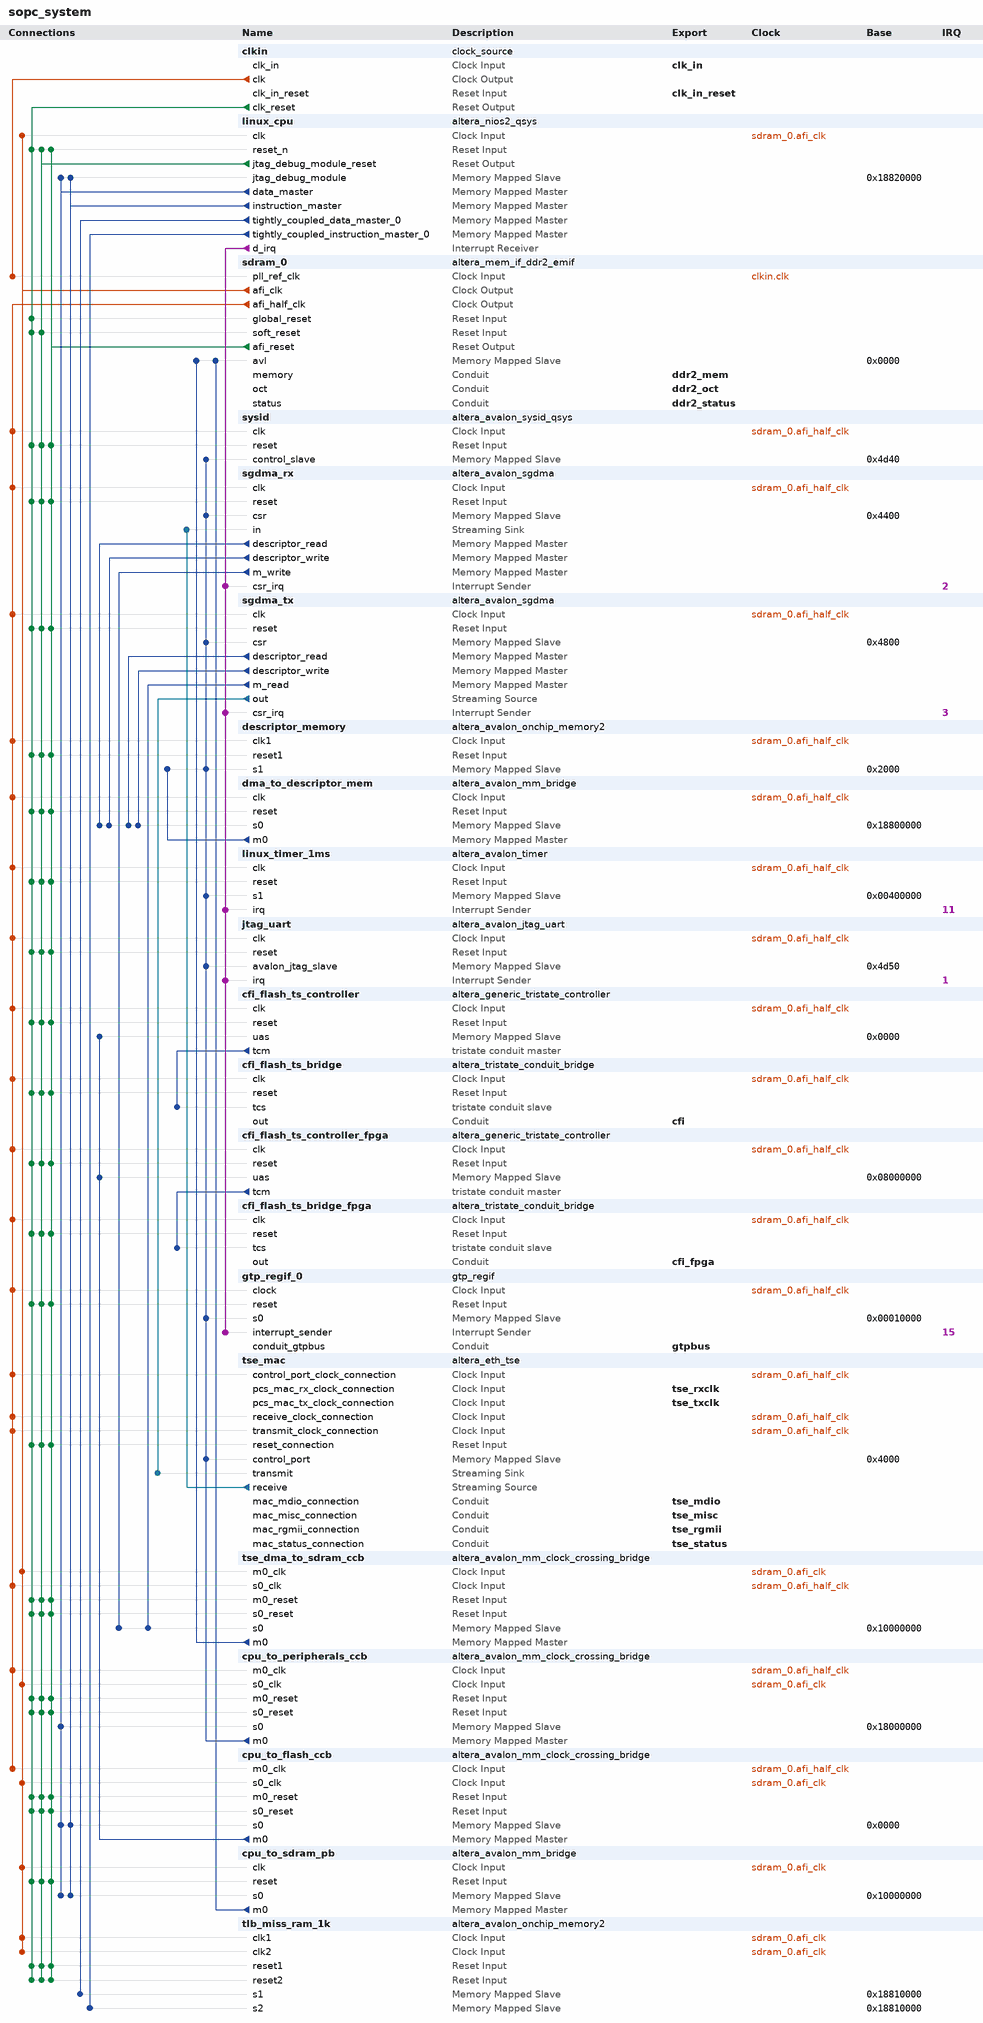
[diagram p0: system contents]
# Platform Designer (Qsys) system sopc_system, Stratix IV EP4SGX180KF40C3
# Parameters at their usual value, and those the tool derives, are not listed.
package require -exact qsys 13.0
create_system sopc_system
set_project_property DEVICE_FAMILY {Stratix IV}
set_project_property DEVICE EP4SGX180KF40C3

add_instance clkin clock_source 13.0
set_instance_parameter_value clkin clockFrequency 250000000
set_instance_parameter_value clkin resetSynchronousEdges BOTH

add_instance linux_cpu altera_nios2_qsys 13.0
set_instance_parameter_value linux_cpu muldiv_divider true
set_instance_parameter_value linux_cpu mmu_enabled true
set_instance_parameter_value linux_cpu cpuID 4674640
set_instance_parameter_value linux_cpu resetSlave cfi_flash_ts_controller.uas
set_instance_parameter_value linux_cpu mmu_TLBMissExcSlave tlb_miss_ram_1k.s2
set_instance_parameter_value linux_cpu exceptionSlave sdram_0.avl
set_instance_parameter_value linux_cpu breakSlave linux_cpu.jtag_debug_module
set_instance_parameter_value linux_cpu muldiv_multiplierType DSPBlock
set_instance_parameter_value linux_cpu impl Fast
set_instance_parameter_value linux_cpu icache_size 32768
set_instance_parameter_value linux_cpu icache_numTCIM 1
set_instance_parameter_value linux_cpu dcache_size 32768
set_instance_parameter_value linux_cpu dcache_numTCDM 1

add_instance sdram_0 altera_mem_if_ddr2_emif 13.0
set_instance_parameter_value sdram_0 MEM_CLK_FREQ 375.0
set_instance_parameter_value sdram_0 MEM_FORMAT DISCRETE
set_instance_parameter_value sdram_0 MEM_ROW_ADDR_WIDTH 13
set_instance_parameter_value sdram_0 MEM_COL_ADDR_WIDTH 10
set_instance_parameter_value sdram_0 MEM_DQ_WIDTH 16
set_instance_parameter_value sdram_0 MEM_BANKADDR_WIDTH 3
set_instance_parameter_value sdram_0 MEM_NUMBER_OF_RANKS_PER_DIMM 1
set_instance_parameter_value sdram_0 MEM_CK_WIDTH 1
set_instance_parameter_value sdram_0 MEM_BL 4
set_instance_parameter_value sdram_0 MEM_SRT {1x refresh rate}
set_instance_parameter_value sdram_0 MEM_TCL 5
set_instance_parameter_value sdram_0 TIMING_TIS 175
set_instance_parameter_value sdram_0 TIMING_TIH 250
set_instance_parameter_value sdram_0 TIMING_TDS 50
set_instance_parameter_value sdram_0 TIMING_TDH 125
set_instance_parameter_value sdram_0 TIMING_TDQSQ 200
set_instance_parameter_value sdram_0 TIMING_TQHS 300
set_instance_parameter_value sdram_0 MEM_TMRD_CK 2
set_instance_parameter_value sdram_0 MEM_TRAS_NS 40.0
set_instance_parameter_value sdram_0 MEM_TRCD_NS 12.5
set_instance_parameter_value sdram_0 MEM_TRP_NS 12.5
set_instance_parameter_value sdram_0 MEM_TRFC_NS 195.0
set_instance_parameter_value sdram_0 MEM_TFAW_NS 45.0
set_instance_parameter_value sdram_0 MEM_TRRD_NS 10.0
set_instance_parameter_value sdram_0 SPEED_GRADE 3
set_instance_parameter_value sdram_0 POWER_OF_TWO_BUS false
set_instance_parameter_value sdram_0 AVL_MAX_SIZE 4
set_instance_parameter_value sdram_0 REF_CLK_FREQ 250.0
set_instance_parameter_value sdram_0 DEFAULT_FAST_SIM_MODEL true
set_instance_parameter_value sdram_0 PLL_SHARING_MODE None
set_instance_parameter_value sdram_0 EXPORT_AFI_HALF_CLK true
set_instance_parameter_value sdram_0 SKIP_MEM_INIT false
set_instance_parameter_value sdram_0 CALIBRATION_MODE Full
set_instance_parameter_value sdram_0 USER_DEBUG_LEVEL 0
set_instance_parameter_value sdram_0 TIMING_BOARD_AC_TO_CK_SKEW 0.0
set_instance_parameter_value sdram_0 CORE_DEBUG_CONNECTION INTERNAL_JTAG
set_instance_parameter_value sdram_0 DLL_SHARING_MODE None

add_instance sysid altera_avalon_sysid_qsys 13.0
set_instance_parameter_value sysid id 4674640

add_instance sgdma_rx altera_avalon_sgdma 13.0.1.99.2
set_instance_parameter_value sgdma_rx enableBurstTransfers false
set_instance_parameter_value sgdma_rx enableUnalignedTransfers false
set_instance_parameter_value sgdma_rx readBlockDataWidth 32
set_instance_parameter_value sgdma_rx sinkErrorWidth 6
set_instance_parameter_value sgdma_rx sourceErrorWidth 0
set_instance_parameter_value sgdma_rx transferMode STREAM_TO_MEMORY
set_instance_parameter_value sgdma_rx writeBurstcountWidth 4

add_instance sgdma_tx altera_avalon_sgdma 13.0.1.99.2
set_instance_parameter_value sgdma_tx enableBurstTransfers false
set_instance_parameter_value sgdma_tx enableUnalignedTransfers false
set_instance_parameter_value sgdma_tx readBlockDataWidth 32
set_instance_parameter_value sgdma_tx sinkErrorWidth 0
set_instance_parameter_value sgdma_tx sourceErrorWidth 1
set_instance_parameter_value sgdma_tx transferMode MEMORY_TO_STREAM
set_instance_parameter_value sgdma_tx writeBurstcountWidth 4

add_instance descriptor_memory altera_avalon_onchip_memory2 13.0.1.99.2
set_instance_parameter_value descriptor_memory dataWidth 32
set_instance_parameter_value descriptor_memory dualPort false
set_instance_parameter_value descriptor_memory initMemContent true
set_instance_parameter_value descriptor_memory initializationFileName descriptor_memory
set_instance_parameter_value descriptor_memory memorySize 8192

add_instance dma_to_descriptor_mem altera_avalon_mm_bridge 13.0
set_instance_parameter_value dma_to_descriptor_mem DATA_WIDTH 32
set_instance_parameter_value dma_to_descriptor_mem ADDRESS_WIDTH 14
set_instance_parameter_value dma_to_descriptor_mem ADDRESS_UNITS SYMBOLS
set_instance_parameter_value dma_to_descriptor_mem MAX_PENDING_RESPONSES 4

add_instance linux_timer_1ms altera_avalon_timer 13.0.1.99.2
set_instance_parameter_value linux_timer_1ms period 1
set_instance_parameter_value linux_timer_1ms periodUnits MSEC

add_instance jtag_uart altera_avalon_jtag_uart 13.0.1.99.2
set_instance_parameter_value jtag_uart simInteractiveOptions INTERACTIVE_ASCII_OUTPUT

add_instance cfi_flash_ts_controller altera_generic_tristate_controller 13.0
set_instance_parameter_value cfi_flash_ts_controller TCM_ADDRESS_W 27
set_instance_parameter_value cfi_flash_ts_controller TCM_DATA_W 16
set_instance_parameter_value cfi_flash_ts_controller TCM_BYTEENABLE_W 2
set_instance_parameter_value cfi_flash_ts_controller TCM_READ_WAIT 230
set_instance_parameter_value cfi_flash_ts_controller TCM_WRITE_WAIT 230
set_instance_parameter_value cfi_flash_ts_controller TCM_SETUP_WAIT 65
set_instance_parameter_value cfi_flash_ts_controller TCM_DATA_HOLD 35
set_instance_parameter_value cfi_flash_ts_controller TCM_MAX_PENDING_READ_TRANSACTIONS 3
set_instance_parameter_value cfi_flash_ts_controller TCM_TURNAROUND_TIME 2
set_instance_parameter_value cfi_flash_ts_controller TCM_TIMING_UNITS 0
set_instance_parameter_value cfi_flash_ts_controller TCM_READLATENCY 2
set_instance_parameter_value cfi_flash_ts_controller TCM_SYMBOLS_PER_WORD 2
set_instance_parameter_value cfi_flash_ts_controller USE_READ 0
set_instance_parameter_value cfi_flash_ts_controller USE_BEGINTRANSFER 0
set_instance_parameter_value cfi_flash_ts_controller USE_BYTEENABLE 0
set_instance_parameter_value cfi_flash_ts_controller USE_OUTPUTENABLE 1
set_instance_parameter_value cfi_flash_ts_controller USE_RESET_OUTPUT 1
set_instance_parameter_value cfi_flash_ts_controller ACTIVE_LOW_READ 1
set_instance_parameter_value cfi_flash_ts_controller ACTIVE_LOW_BYTEENABLE 0
set_instance_parameter_value cfi_flash_ts_controller ACTIVE_LOW_OUTPUTENABLE 1
set_instance_parameter_value cfi_flash_ts_controller ACTIVE_LOW_BEGINTRANSFER 0
set_instance_parameter_value cfi_flash_ts_controller ACTIVE_LOW_RESET_OUTPUT 1
set_instance_parameter_value cfi_flash_ts_controller CHIPSELECT_THROUGH_READLATENCY 0
set_instance_parameter_value cfi_flash_ts_controller MODULE_ASSIGNMENT_KEYS embeddedsw.configuration.hwClassnameDriverSupportList,embeddedsw.configuration.hwClassnameDriverSupportDefault,embeddedsw.CMacro.SETUP_VALUE,embeddedsw.CMacro.WAIT_VALUE,embeddedsw.CMacro.HOLD_VALUE,embeddedsw.CMacro.TIMING_UNITS,embeddedsw.CMacro.SIZE,embeddedsw.memoryInfo.MEM_INIT_DATA_WIDTH,embeddedsw.memoryInfo.HAS_BYTE_LANE,embeddedsw.memoryInfo.IS_FLASH,embeddedsw.memoryInfo.GENERATE_DAT_SYM,embeddedsw.memoryInfo.GENERATE_FLASH,embeddedsw.memoryInfo.DAT_SYM_INSTALL_DIR,embeddedsw.memoryInfo.FLASH_INSTALL_DIR
set_instance_parameter_value cfi_flash_ts_controller MODULE_ASSIGNMENT_VALUES altera_avalon_lan91c111:altera_avalon_cfi_flash,altera_avalon_cfi_flash,50,200,10,ns,134217728u,16,0,1,1,1,SIM_DIR,APP_DIR

add_instance cfi_flash_ts_bridge altera_tristate_conduit_bridge 13.0

add_instance cfi_flash_ts_controller_fpga altera_generic_tristate_controller 13.0
set_instance_parameter_value cfi_flash_ts_controller_fpga TCM_ADDRESS_W 27
set_instance_parameter_value cfi_flash_ts_controller_fpga TCM_DATA_W 16
set_instance_parameter_value cfi_flash_ts_controller_fpga TCM_BYTEENABLE_W 2
set_instance_parameter_value cfi_flash_ts_controller_fpga TCM_READ_WAIT 230
set_instance_parameter_value cfi_flash_ts_controller_fpga TCM_WRITE_WAIT 230
set_instance_parameter_value cfi_flash_ts_controller_fpga TCM_SETUP_WAIT 65
set_instance_parameter_value cfi_flash_ts_controller_fpga TCM_DATA_HOLD 35
set_instance_parameter_value cfi_flash_ts_controller_fpga TCM_MAX_PENDING_READ_TRANSACTIONS 3
set_instance_parameter_value cfi_flash_ts_controller_fpga TCM_TURNAROUND_TIME 2
set_instance_parameter_value cfi_flash_ts_controller_fpga TCM_TIMING_UNITS 0
set_instance_parameter_value cfi_flash_ts_controller_fpga TCM_READLATENCY 2
set_instance_parameter_value cfi_flash_ts_controller_fpga TCM_SYMBOLS_PER_WORD 2
set_instance_parameter_value cfi_flash_ts_controller_fpga USE_READ 0
set_instance_parameter_value cfi_flash_ts_controller_fpga USE_BEGINTRANSFER 0
set_instance_parameter_value cfi_flash_ts_controller_fpga USE_BYTEENABLE 0
set_instance_parameter_value cfi_flash_ts_controller_fpga USE_OUTPUTENABLE 1
set_instance_parameter_value cfi_flash_ts_controller_fpga USE_RESET_OUTPUT 1
set_instance_parameter_value cfi_flash_ts_controller_fpga ACTIVE_LOW_READ 1
set_instance_parameter_value cfi_flash_ts_controller_fpga ACTIVE_LOW_BYTEENABLE 0
set_instance_parameter_value cfi_flash_ts_controller_fpga ACTIVE_LOW_OUTPUTENABLE 1
set_instance_parameter_value cfi_flash_ts_controller_fpga ACTIVE_LOW_BEGINTRANSFER 0
set_instance_parameter_value cfi_flash_ts_controller_fpga ACTIVE_LOW_RESET_OUTPUT 1
set_instance_parameter_value cfi_flash_ts_controller_fpga CHIPSELECT_THROUGH_READLATENCY 0
set_instance_parameter_value cfi_flash_ts_controller_fpga MODULE_ASSIGNMENT_KEYS embeddedsw.configuration.hwClassnameDriverSupportList,embeddedsw.configuration.hwClassnameDriverSupportDefault,embeddedsw.CMacro.SETUP_VALUE,embeddedsw.CMacro.WAIT_VALUE,embeddedsw.CMacro.HOLD_VALUE,embeddedsw.CMacro.TIMING_UNITS,embeddedsw.CMacro.SIZE,embeddedsw.memoryInfo.MEM_INIT_DATA_WIDTH,embeddedsw.memoryInfo.HAS_BYTE_LANE,embeddedsw.memoryInfo.IS_FLASH,embeddedsw.memoryInfo.GENERATE_DAT_SYM,embeddedsw.memoryInfo.GENERATE_FLASH,embeddedsw.memoryInfo.DAT_SYM_INSTALL_DIR,embeddedsw.memoryInfo.FLASH_INSTALL_DIR
set_instance_parameter_value cfi_flash_ts_controller_fpga MODULE_ASSIGNMENT_VALUES altera_avalon_lan91c111:altera_avalon_cfi_flash,altera_avalon_cfi_flash,50,200,10,ns,134217728u,16,0,1,1,1,SIM_DIR,APP_DIR

add_instance cfi_flash_ts_bridge_fpga altera_tristate_conduit_bridge 13.0

add_instance gtp_regif_0 gtp_regif 1.0

add_instance tse_mac altera_eth_tse 13.0
set_instance_parameter_value tse_mac core_variation MAC_ONLY
set_instance_parameter_value tse_mac ifGMII RGMII
set_instance_parameter_value tse_mac transceiver_type NONE
set_instance_parameter_value tse_mac enable_hd_logic true
set_instance_parameter_value tse_mac stat_cnt_ena true
set_instance_parameter_value tse_mac enable_shift16 true
set_instance_parameter_value tse_mac enable_mac_flow_ctrl true
set_instance_parameter_value tse_mac enable_magic_detect false
set_instance_parameter_value tse_mac mdio_clk_div 80
set_instance_parameter_value tse_mac ing_addr 11

add_instance tse_dma_to_sdram_ccb altera_avalon_mm_clock_crossing_bridge 13.0
set_instance_parameter_value tse_dma_to_sdram_ccb DATA_WIDTH 32
set_instance_parameter_value tse_dma_to_sdram_ccb ADDRESS_WIDTH 27
set_instance_parameter_value tse_dma_to_sdram_ccb MAX_BURST_SIZE 1
set_instance_parameter_value tse_dma_to_sdram_ccb COMMAND_FIFO_DEPTH 4
set_instance_parameter_value tse_dma_to_sdram_ccb RESPONSE_FIFO_DEPTH 4
set_instance_parameter_value tse_dma_to_sdram_ccb MASTER_SYNC_DEPTH 2
set_instance_parameter_value tse_dma_to_sdram_ccb SLAVE_SYNC_DEPTH 2

add_instance cpu_to_peripherals_ccb altera_avalon_mm_clock_crossing_bridge 13.0
set_instance_parameter_value cpu_to_peripherals_ccb DATA_WIDTH 32
set_instance_parameter_value cpu_to_peripherals_ccb ADDRESS_WIDTH 23
set_instance_parameter_value cpu_to_peripherals_ccb MAX_BURST_SIZE 1
set_instance_parameter_value cpu_to_peripherals_ccb COMMAND_FIFO_DEPTH 4
set_instance_parameter_value cpu_to_peripherals_ccb RESPONSE_FIFO_DEPTH 4
set_instance_parameter_value cpu_to_peripherals_ccb MASTER_SYNC_DEPTH 2
set_instance_parameter_value cpu_to_peripherals_ccb SLAVE_SYNC_DEPTH 2

add_instance cpu_to_flash_ccb altera_avalon_mm_clock_crossing_bridge 13.0
set_instance_parameter_value cpu_to_flash_ccb DATA_WIDTH 32
set_instance_parameter_value cpu_to_flash_ccb ADDRESS_WIDTH 28
set_instance_parameter_value cpu_to_flash_ccb MAX_BURST_SIZE 1
set_instance_parameter_value cpu_to_flash_ccb COMMAND_FIFO_DEPTH 4
set_instance_parameter_value cpu_to_flash_ccb RESPONSE_FIFO_DEPTH 4
set_instance_parameter_value cpu_to_flash_ccb MASTER_SYNC_DEPTH 2
set_instance_parameter_value cpu_to_flash_ccb SLAVE_SYNC_DEPTH 2

add_instance cpu_to_sdram_pb altera_avalon_mm_bridge 13.0
set_instance_parameter_value cpu_to_sdram_pb DATA_WIDTH 32
set_instance_parameter_value cpu_to_sdram_pb ADDRESS_WIDTH 27
set_instance_parameter_value cpu_to_sdram_pb ADDRESS_UNITS SYMBOLS
set_instance_parameter_value cpu_to_sdram_pb MAX_PENDING_RESPONSES 4

add_instance tlb_miss_ram_1k altera_avalon_onchip_memory2 13.0.1.99.2
set_instance_parameter_value tlb_miss_ram_1k dataWidth 32
set_instance_parameter_value tlb_miss_ram_1k dualPort true
set_instance_parameter_value tlb_miss_ram_1k initMemContent true
set_instance_parameter_value tlb_miss_ram_1k initializationFileName onchip_mem.hex
set_instance_parameter_value tlb_miss_ram_1k memorySize 1024

# connections
add_connection clkin.clk sdram_0.pll_ref_clk clock
add_connection sdram_0.afi_clk cpu_to_flash_ccb.s0_clk clock
add_connection sdram_0.afi_clk cpu_to_peripherals_ccb.s0_clk clock
add_connection sdram_0.afi_clk cpu_to_sdram_pb.clk clock
add_connection sdram_0.afi_clk linux_cpu.clk clock
add_connection sdram_0.afi_clk tlb_miss_ram_1k.clk1 clock
add_connection sdram_0.afi_clk tlb_miss_ram_1k.clk2 clock
add_connection sdram_0.afi_clk tse_dma_to_sdram_ccb.m0_clk clock
add_connection sdram_0.afi_half_clk cfi_flash_ts_bridge.clk clock
add_connection sdram_0.afi_half_clk cfi_flash_ts_bridge_fpga.clk clock
add_connection sdram_0.afi_half_clk cfi_flash_ts_controller.clk clock
add_connection sdram_0.afi_half_clk cfi_flash_ts_controller_fpga.clk clock
add_connection sdram_0.afi_half_clk cpu_to_flash_ccb.m0_clk clock
add_connection sdram_0.afi_half_clk cpu_to_peripherals_ccb.m0_clk clock
add_connection sdram_0.afi_half_clk descriptor_memory.clk1 clock
add_connection sdram_0.afi_half_clk dma_to_descriptor_mem.clk clock
add_connection sdram_0.afi_half_clk gtp_regif_0.clock clock
add_connection sdram_0.afi_half_clk jtag_uart.clk clock
add_connection sdram_0.afi_half_clk linux_timer_1ms.clk clock
add_connection sdram_0.afi_half_clk sgdma_rx.clk clock
add_connection sdram_0.afi_half_clk sgdma_tx.clk clock
add_connection sdram_0.afi_half_clk sysid.clk clock
add_connection sdram_0.afi_half_clk tse_dma_to_sdram_ccb.s0_clk clock
add_connection sdram_0.afi_half_clk tse_mac.control_port_clock_connection clock
add_connection sdram_0.afi_half_clk tse_mac.receive_clock_connection clock
add_connection sdram_0.afi_half_clk tse_mac.transmit_clock_connection clock
add_connection clkin.clk_reset cfi_flash_ts_bridge.reset reset
add_connection clkin.clk_reset cfi_flash_ts_bridge_fpga.reset reset
add_connection clkin.clk_reset cfi_flash_ts_controller.reset reset
add_connection clkin.clk_reset cfi_flash_ts_controller_fpga.reset reset
add_connection clkin.clk_reset cpu_to_flash_ccb.m0_reset reset
add_connection clkin.clk_reset cpu_to_flash_ccb.s0_reset reset
add_connection clkin.clk_reset cpu_to_peripherals_ccb.m0_reset reset
add_connection clkin.clk_reset cpu_to_peripherals_ccb.s0_reset reset
add_connection clkin.clk_reset cpu_to_sdram_pb.reset reset
add_connection clkin.clk_reset descriptor_memory.reset1 reset
add_connection clkin.clk_reset dma_to_descriptor_mem.reset reset
add_connection clkin.clk_reset gtp_regif_0.reset reset
add_connection clkin.clk_reset jtag_uart.reset reset
add_connection clkin.clk_reset linux_cpu.reset_n reset
add_connection clkin.clk_reset linux_timer_1ms.reset reset
add_connection clkin.clk_reset sdram_0.global_reset reset
add_connection clkin.clk_reset sdram_0.soft_reset reset
add_connection clkin.clk_reset sgdma_rx.reset reset
add_connection clkin.clk_reset sgdma_tx.reset reset
add_connection clkin.clk_reset sysid.reset reset
add_connection clkin.clk_reset tlb_miss_ram_1k.reset1 reset
add_connection clkin.clk_reset tlb_miss_ram_1k.reset2 reset
add_connection clkin.clk_reset tse_dma_to_sdram_ccb.m0_reset reset
add_connection clkin.clk_reset tse_dma_to_sdram_ccb.s0_reset reset
add_connection clkin.clk_reset tse_mac.reset_connection reset
add_connection linux_cpu.jtag_debug_module_reset cfi_flash_ts_bridge.reset reset
add_connection linux_cpu.jtag_debug_module_reset cfi_flash_ts_bridge_fpga.reset reset
add_connection linux_cpu.jtag_debug_module_reset cfi_flash_ts_controller.reset reset
add_connection linux_cpu.jtag_debug_module_reset cfi_flash_ts_controller_fpga.reset reset
add_connection linux_cpu.jtag_debug_module_reset cpu_to_flash_ccb.m0_reset reset
add_connection linux_cpu.jtag_debug_module_reset cpu_to_flash_ccb.s0_reset reset
add_connection linux_cpu.jtag_debug_module_reset cpu_to_peripherals_ccb.m0_reset reset
add_connection linux_cpu.jtag_debug_module_reset cpu_to_peripherals_ccb.s0_reset reset
add_connection linux_cpu.jtag_debug_module_reset cpu_to_sdram_pb.reset reset
add_connection linux_cpu.jtag_debug_module_reset descriptor_memory.reset1 reset
add_connection linux_cpu.jtag_debug_module_reset dma_to_descriptor_mem.reset reset
add_connection linux_cpu.jtag_debug_module_reset gtp_regif_0.reset reset
add_connection linux_cpu.jtag_debug_module_reset jtag_uart.reset reset
add_connection linux_cpu.jtag_debug_module_reset linux_cpu.reset_n reset
add_connection linux_cpu.jtag_debug_module_reset linux_timer_1ms.reset reset
add_connection linux_cpu.jtag_debug_module_reset sdram_0.soft_reset reset
add_connection linux_cpu.jtag_debug_module_reset sgdma_rx.reset reset
add_connection linux_cpu.jtag_debug_module_reset sgdma_tx.reset reset
add_connection linux_cpu.jtag_debug_module_reset sysid.reset reset
add_connection linux_cpu.jtag_debug_module_reset tlb_miss_ram_1k.reset1 reset
add_connection linux_cpu.jtag_debug_module_reset tlb_miss_ram_1k.reset2 reset
add_connection linux_cpu.jtag_debug_module_reset tse_dma_to_sdram_ccb.m0_reset reset
add_connection linux_cpu.jtag_debug_module_reset tse_dma_to_sdram_ccb.s0_reset reset
add_connection linux_cpu.jtag_debug_module_reset tse_mac.reset_connection reset
add_connection sdram_0.afi_reset cfi_flash_ts_bridge.reset reset
add_connection sdram_0.afi_reset cfi_flash_ts_bridge_fpga.reset reset
add_connection sdram_0.afi_reset cfi_flash_ts_controller.reset reset
add_connection sdram_0.afi_reset cfi_flash_ts_controller_fpga.reset reset
add_connection sdram_0.afi_reset cpu_to_flash_ccb.m0_reset reset
add_connection sdram_0.afi_reset cpu_to_flash_ccb.s0_reset reset
add_connection sdram_0.afi_reset cpu_to_peripherals_ccb.m0_reset reset
add_connection sdram_0.afi_reset cpu_to_peripherals_ccb.s0_reset reset
add_connection sdram_0.afi_reset cpu_to_sdram_pb.reset reset
add_connection sdram_0.afi_reset descriptor_memory.reset1 reset
add_connection sdram_0.afi_reset dma_to_descriptor_mem.reset reset
add_connection sdram_0.afi_reset gtp_regif_0.reset reset
add_connection sdram_0.afi_reset jtag_uart.reset reset
add_connection sdram_0.afi_reset linux_cpu.reset_n reset
add_connection sdram_0.afi_reset linux_timer_1ms.reset reset
add_connection sdram_0.afi_reset sgdma_rx.reset reset
add_connection sdram_0.afi_reset sgdma_tx.reset reset
add_connection sdram_0.afi_reset sysid.reset reset
add_connection sdram_0.afi_reset tlb_miss_ram_1k.reset1 reset
add_connection sdram_0.afi_reset tlb_miss_ram_1k.reset2 reset
add_connection sdram_0.afi_reset tse_dma_to_sdram_ccb.m0_reset reset
add_connection sdram_0.afi_reset tse_dma_to_sdram_ccb.s0_reset reset
add_connection sdram_0.afi_reset tse_mac.reset_connection reset
add_connection cpu_to_flash_ccb.m0 cfi_flash_ts_controller.uas avalon
set_connection_parameter_value cpu_to_flash_ccb.m0/cfi_flash_ts_controller.uas baseAddress 0x0000
add_connection cpu_to_flash_ccb.m0 cfi_flash_ts_controller_fpga.uas avalon
set_connection_parameter_value cpu_to_flash_ccb.m0/cfi_flash_ts_controller_fpga.uas baseAddress 0x08000000
add_connection cpu_to_peripherals_ccb.m0 descriptor_memory.s1 avalon
set_connection_parameter_value cpu_to_peripherals_ccb.m0/descriptor_memory.s1 baseAddress 0x2000
add_connection cpu_to_peripherals_ccb.m0 gtp_regif_0.s0 avalon
set_connection_parameter_value cpu_to_peripherals_ccb.m0/gtp_regif_0.s0 baseAddress 0x00010000
add_connection cpu_to_peripherals_ccb.m0 jtag_uart.avalon_jtag_slave avalon
set_connection_parameter_value cpu_to_peripherals_ccb.m0/jtag_uart.avalon_jtag_slave baseAddress 0x4d50
add_connection cpu_to_peripherals_ccb.m0 linux_timer_1ms.s1 avalon
set_connection_parameter_value cpu_to_peripherals_ccb.m0/linux_timer_1ms.s1 baseAddress 0x00400000
add_connection cpu_to_peripherals_ccb.m0 sgdma_rx.csr avalon
set_connection_parameter_value cpu_to_peripherals_ccb.m0/sgdma_rx.csr baseAddress 0x4400
add_connection cpu_to_peripherals_ccb.m0 sgdma_tx.csr avalon
set_connection_parameter_value cpu_to_peripherals_ccb.m0/sgdma_tx.csr baseAddress 0x4800
add_connection cpu_to_peripherals_ccb.m0 sysid.control_slave avalon
set_connection_parameter_value cpu_to_peripherals_ccb.m0/sysid.control_slave baseAddress 0x4d40
add_connection cpu_to_peripherals_ccb.m0 tse_mac.control_port avalon
set_connection_parameter_value cpu_to_peripherals_ccb.m0/tse_mac.control_port baseAddress 0x4000
add_connection cpu_to_sdram_pb.m0 sdram_0.avl avalon
set_connection_parameter_value cpu_to_sdram_pb.m0/sdram_0.avl baseAddress 0x0000
add_connection dma_to_descriptor_mem.m0 descriptor_memory.s1 avalon
set_connection_parameter_value dma_to_descriptor_mem.m0/descriptor_memory.s1 baseAddress 0x2000
add_connection linux_cpu.data_master cpu_to_flash_ccb.s0 avalon
set_connection_parameter_value linux_cpu.data_master/cpu_to_flash_ccb.s0 baseAddress 0x0000
add_connection linux_cpu.data_master cpu_to_peripherals_ccb.s0 avalon
set_connection_parameter_value linux_cpu.data_master/cpu_to_peripherals_ccb.s0 baseAddress 0x18000000
add_connection linux_cpu.data_master cpu_to_sdram_pb.s0 avalon
set_connection_parameter_value linux_cpu.data_master/cpu_to_sdram_pb.s0 baseAddress 0x10000000
add_connection linux_cpu.data_master linux_cpu.jtag_debug_module avalon
set_connection_parameter_value linux_cpu.data_master/linux_cpu.jtag_debug_module baseAddress 0x18820000
add_connection linux_cpu.instruction_master cpu_to_flash_ccb.s0 avalon
set_connection_parameter_value linux_cpu.instruction_master/cpu_to_flash_ccb.s0 baseAddress 0x0000
add_connection linux_cpu.instruction_master cpu_to_sdram_pb.s0 avalon
set_connection_parameter_value linux_cpu.instruction_master/cpu_to_sdram_pb.s0 baseAddress 0x10000000
add_connection linux_cpu.instruction_master linux_cpu.jtag_debug_module avalon
set_connection_parameter_value linux_cpu.instruction_master/linux_cpu.jtag_debug_module baseAddress 0x18820000
add_connection linux_cpu.tightly_coupled_data_master_0 tlb_miss_ram_1k.s1 avalon
set_connection_parameter_value linux_cpu.tightly_coupled_data_master_0/tlb_miss_ram_1k.s1 baseAddress 0x18810000
add_connection linux_cpu.tightly_coupled_instruction_master_0 tlb_miss_ram_1k.s2 avalon
set_connection_parameter_value linux_cpu.tightly_coupled_instruction_master_0/tlb_miss_ram_1k.s2 baseAddress 0x18810000
add_connection sgdma_rx.descriptor_read dma_to_descriptor_mem.s0 avalon
set_connection_parameter_value sgdma_rx.descriptor_read/dma_to_descriptor_mem.s0 baseAddress 0x18800000
add_connection sgdma_rx.descriptor_write dma_to_descriptor_mem.s0 avalon
set_connection_parameter_value sgdma_rx.descriptor_write/dma_to_descriptor_mem.s0 baseAddress 0x18800000
add_connection sgdma_rx.m_write tse_dma_to_sdram_ccb.s0 avalon
set_connection_parameter_value sgdma_rx.m_write/tse_dma_to_sdram_ccb.s0 baseAddress 0x10000000
add_connection sgdma_tx.descriptor_read dma_to_descriptor_mem.s0 avalon
set_connection_parameter_value sgdma_tx.descriptor_read/dma_to_descriptor_mem.s0 baseAddress 0x18800000
add_connection sgdma_tx.descriptor_write dma_to_descriptor_mem.s0 avalon
set_connection_parameter_value sgdma_tx.descriptor_write/dma_to_descriptor_mem.s0 baseAddress 0x18800000
add_connection sgdma_tx.m_read tse_dma_to_sdram_ccb.s0 avalon
set_connection_parameter_value sgdma_tx.m_read/tse_dma_to_sdram_ccb.s0 baseAddress 0x10000000
add_connection tse_dma_to_sdram_ccb.m0 sdram_0.avl avalon
set_connection_parameter_value tse_dma_to_sdram_ccb.m0/sdram_0.avl baseAddress 0x0000
add_connection sgdma_tx.out tse_mac.transmit avalon_streaming
add_connection tse_mac.receive sgdma_rx.in avalon_streaming
add_connection linux_cpu.d_irq gtp_regif_0.interrupt_sender interrupt
set_connection_parameter_value linux_cpu.d_irq/gtp_regif_0.interrupt_sender irqNumber 15
add_connection linux_cpu.d_irq jtag_uart.irq interrupt
set_connection_parameter_value linux_cpu.d_irq/jtag_uart.irq irqNumber 1
add_connection linux_cpu.d_irq linux_timer_1ms.irq interrupt
set_connection_parameter_value linux_cpu.d_irq/linux_timer_1ms.irq irqNumber 11
add_connection linux_cpu.d_irq sgdma_rx.csr_irq interrupt
set_connection_parameter_value linux_cpu.d_irq/sgdma_rx.csr_irq irqNumber 2
add_connection linux_cpu.d_irq sgdma_tx.csr_irq interrupt
set_connection_parameter_value linux_cpu.d_irq/sgdma_tx.csr_irq irqNumber 3
add_connection cfi_flash_ts_controller.tcm cfi_flash_ts_bridge.tcs tristate_conduit
add_connection cfi_flash_ts_controller_fpga.tcm cfi_flash_ts_bridge_fpga.tcs tristate_conduit

# exported interfaces
add_interface clk_in_reset reset sink
set_interface_property clk_in_reset EXPORT_OF clkin.clk_in_reset
add_interface clk_in clock sink
set_interface_property clk_in EXPORT_OF clkin.clk_in
add_interface ddr2_status conduit end
set_interface_property ddr2_status EXPORT_OF sdram_0.status
add_interface ddr2_mem conduit end
set_interface_property ddr2_mem EXPORT_OF sdram_0.memory
add_interface cfi conduit end
set_interface_property cfi EXPORT_OF cfi_flash_ts_bridge.out
add_interface ddr2_oct conduit end
set_interface_property ddr2_oct EXPORT_OF sdram_0.oct
add_interface gtpbus conduit end
set_interface_property gtpbus EXPORT_OF gtp_regif_0.conduit_gtpbus
add_interface tse_mdio conduit end
set_interface_property tse_mdio EXPORT_OF tse_mac.mac_mdio_connection
add_interface tse_rgmii conduit end
set_interface_property tse_rgmii EXPORT_OF tse_mac.mac_rgmii_connection
add_interface tse_status conduit end
set_interface_property tse_status EXPORT_OF tse_mac.mac_status_connection
add_interface tse_txclk clock sink
set_interface_property tse_txclk EXPORT_OF tse_mac.pcs_mac_tx_clock_connection
add_interface tse_rxclk clock sink
set_interface_property tse_rxclk EXPORT_OF tse_mac.pcs_mac_rx_clock_connection
add_interface cfi_fpga conduit end
set_interface_property cfi_fpga EXPORT_OF cfi_flash_ts_bridge_fpga.out
add_interface tse_misc conduit end
set_interface_property tse_misc EXPORT_OF tse_mac.mac_misc_connection

set_interconnect_requirement {$system} qsys_mm.clockCrossingAdapter HANDSHAKE
set_interconnect_requirement {$system} qsys_mm.maxAdditionalLatency 1

save_system sopc_system.qsys
